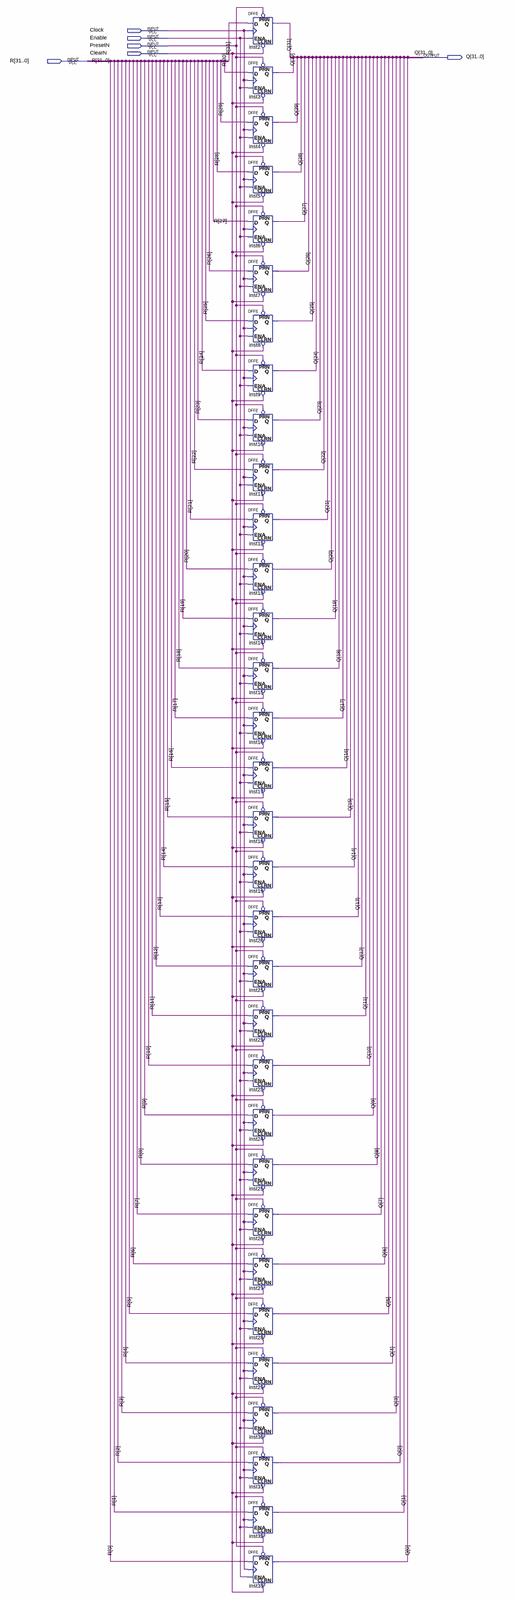
[diagram p0: schematic sheet, whole]
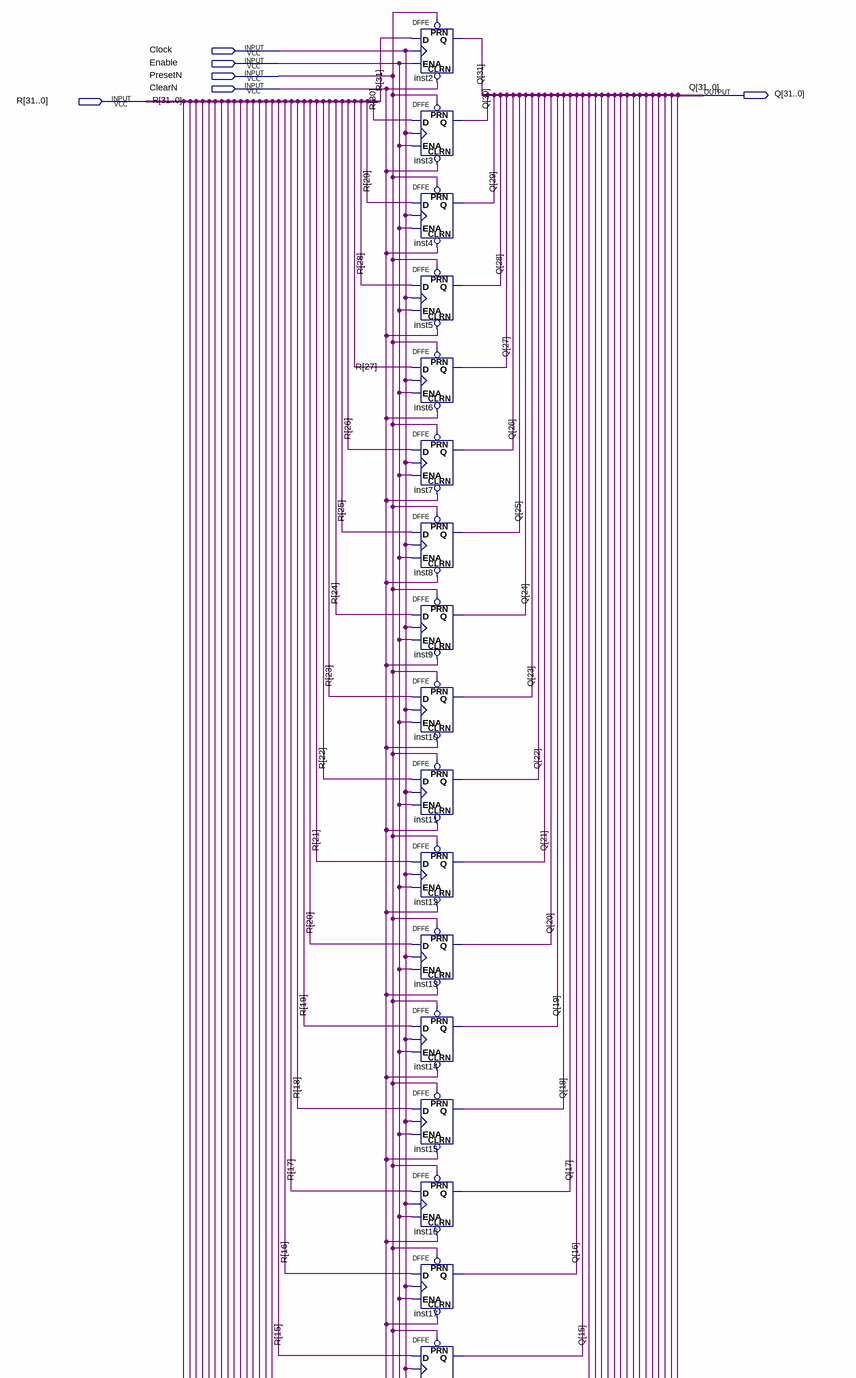
[diagram p1: schematic sheet, upper part]
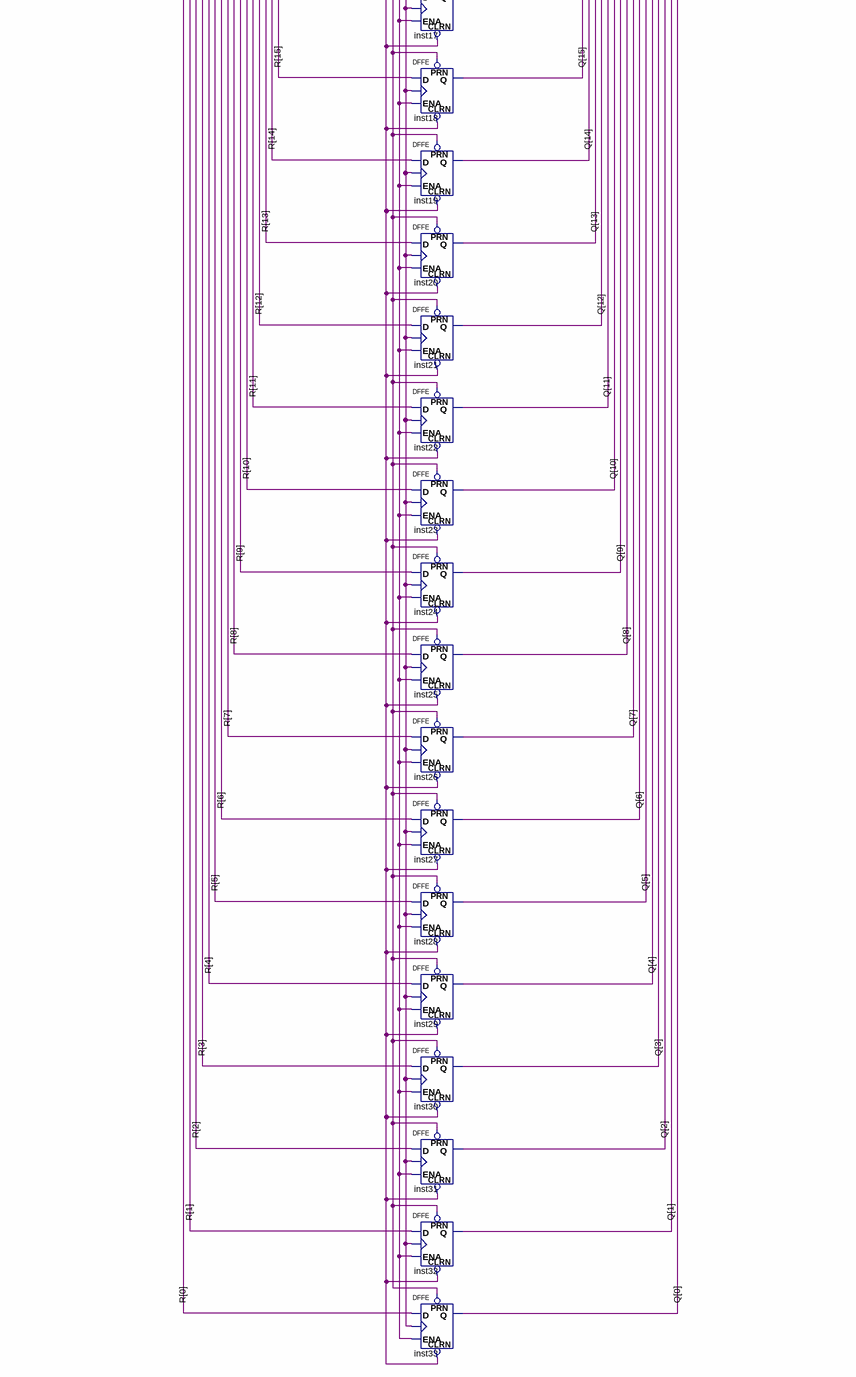
[diagram p2: schematic sheet, lower part]
// Quartus schematic Register.bdf as structural Verilog: 32 symbols, 6 pins
module Register (
  input  Clock,
  input  Enable,
  input  PresetN,
  input  ClearN,
  input  [31:0] R,
  output [31:0] Q
);

  DFFE inst2 (.PRN(PresetN), .CLRN(ClearN), .D(R[31]), .CLK(Clock), .ENA(Enable), .Q(Q[31]));
  DFFE inst3 (.PRN(PresetN), .CLRN(ClearN), .D(R[30]), .CLK(Clock), .ENA(Enable), .Q(Q[30]));
  DFFE inst4 (.PRN(PresetN), .CLRN(ClearN), .D(R[29]), .CLK(Clock), .ENA(Enable), .Q(Q[29]));
  DFFE inst5 (.PRN(PresetN), .CLRN(ClearN), .D(R[28]), .CLK(Clock), .ENA(Enable), .Q(Q[28]));
  DFFE inst6 (.PRN(PresetN), .CLRN(ClearN), .D(R[27]), .CLK(Clock), .ENA(Enable), .Q(Q[27]));
  DFFE inst7 (.PRN(PresetN), .CLRN(ClearN), .D(R[26]), .CLK(Clock), .ENA(Enable), .Q(Q[26]));
  DFFE inst8 (.PRN(PresetN), .CLRN(ClearN), .D(R[25]), .CLK(Clock), .ENA(Enable), .Q(Q[25]));
  DFFE inst9 (.PRN(PresetN), .CLRN(ClearN), .D(R[24]), .CLK(Clock), .ENA(Enable), .Q(Q[24]));
  DFFE inst10 (.PRN(PresetN), .CLRN(ClearN), .D(R[23]), .CLK(Clock), .ENA(Enable), .Q(Q[23]));
  DFFE inst11 (.PRN(PresetN), .CLRN(ClearN), .D(R[22]), .CLK(Clock), .ENA(Enable), .Q(Q[22]));
  DFFE inst12 (.PRN(PresetN), .CLRN(ClearN), .D(R[21]), .CLK(Clock), .ENA(Enable), .Q(Q[21]));
  DFFE inst13 (.PRN(PresetN), .CLRN(ClearN), .D(R[20]), .CLK(Clock), .ENA(Enable), .Q(Q[20]));
  DFFE inst14 (.PRN(PresetN), .CLRN(ClearN), .D(R[19]), .CLK(Clock), .ENA(Enable), .Q(Q[19]));
  DFFE inst15 (.PRN(PresetN), .CLRN(ClearN), .D(R[18]), .CLK(Clock), .ENA(Enable), .Q(Q[18]));
  DFFE inst16 (.PRN(PresetN), .CLRN(ClearN), .D(R[17]), .CLK(Clock), .ENA(Enable), .Q(Q[17]));
  DFFE inst17 (.PRN(PresetN), .CLRN(ClearN), .D(R[16]), .CLK(Clock), .ENA(Enable), .Q(Q[16]));
  DFFE inst18 (.PRN(PresetN), .CLRN(ClearN), .D(R[15]), .CLK(Clock), .ENA(Enable), .Q(Q[15]));
  DFFE inst19 (.PRN(PresetN), .CLRN(ClearN), .D(R[14]), .CLK(Clock), .ENA(Enable), .Q(Q[14]));
  DFFE inst20 (.PRN(PresetN), .CLRN(ClearN), .D(R[13]), .CLK(Clock), .ENA(Enable), .Q(Q[13]));
  DFFE inst21 (.PRN(PresetN), .CLRN(ClearN), .D(R[12]), .CLK(Clock), .ENA(Enable), .Q(Q[12]));
  DFFE inst22 (.PRN(PresetN), .CLRN(ClearN), .D(R[11]), .CLK(Clock), .ENA(Enable), .Q(Q[11]));
  DFFE inst23 (.PRN(PresetN), .CLRN(ClearN), .D(R[10]), .CLK(Clock), .ENA(Enable), .Q(Q[10]));
  DFFE inst24 (.PRN(PresetN), .CLRN(ClearN), .D(R[9]), .CLK(Clock), .ENA(Enable), .Q(Q[9]));
  DFFE inst25 (.PRN(PresetN), .CLRN(ClearN), .D(R[8]), .CLK(Clock), .ENA(Enable), .Q(Q[8]));
  DFFE inst26 (.PRN(PresetN), .CLRN(ClearN), .D(R[7]), .CLK(Clock), .ENA(Enable), .Q(Q[7]));
  DFFE inst27 (.PRN(PresetN), .CLRN(ClearN), .D(R[6]), .CLK(Clock), .ENA(Enable), .Q(Q[6]));
  DFFE inst28 (.PRN(PresetN), .CLRN(ClearN), .D(R[5]), .CLK(Clock), .ENA(Enable), .Q(Q[5]));
  DFFE inst29 (.PRN(PresetN), .CLRN(ClearN), .D(R[4]), .CLK(Clock), .ENA(Enable), .Q(Q[4]));
  DFFE inst30 (.PRN(PresetN), .CLRN(ClearN), .D(R[3]), .CLK(Clock), .ENA(Enable), .Q(Q[3]));
  DFFE inst31 (.PRN(PresetN), .CLRN(ClearN), .D(R[2]), .CLK(Clock), .ENA(Enable), .Q(Q[2]));
  DFFE inst32 (.PRN(PresetN), .CLRN(ClearN), .D(R[1]), .CLK(Clock), .ENA(Enable), .Q(Q[1]));
  DFFE inst33 (.PRN(PresetN), .CLRN(ClearN), .D(R[0]), .CLK(Clock), .ENA(Enable), .Q(Q[0]));
endmodule
